# EAGLE design charliewatch (EAGLE 9.4.0)
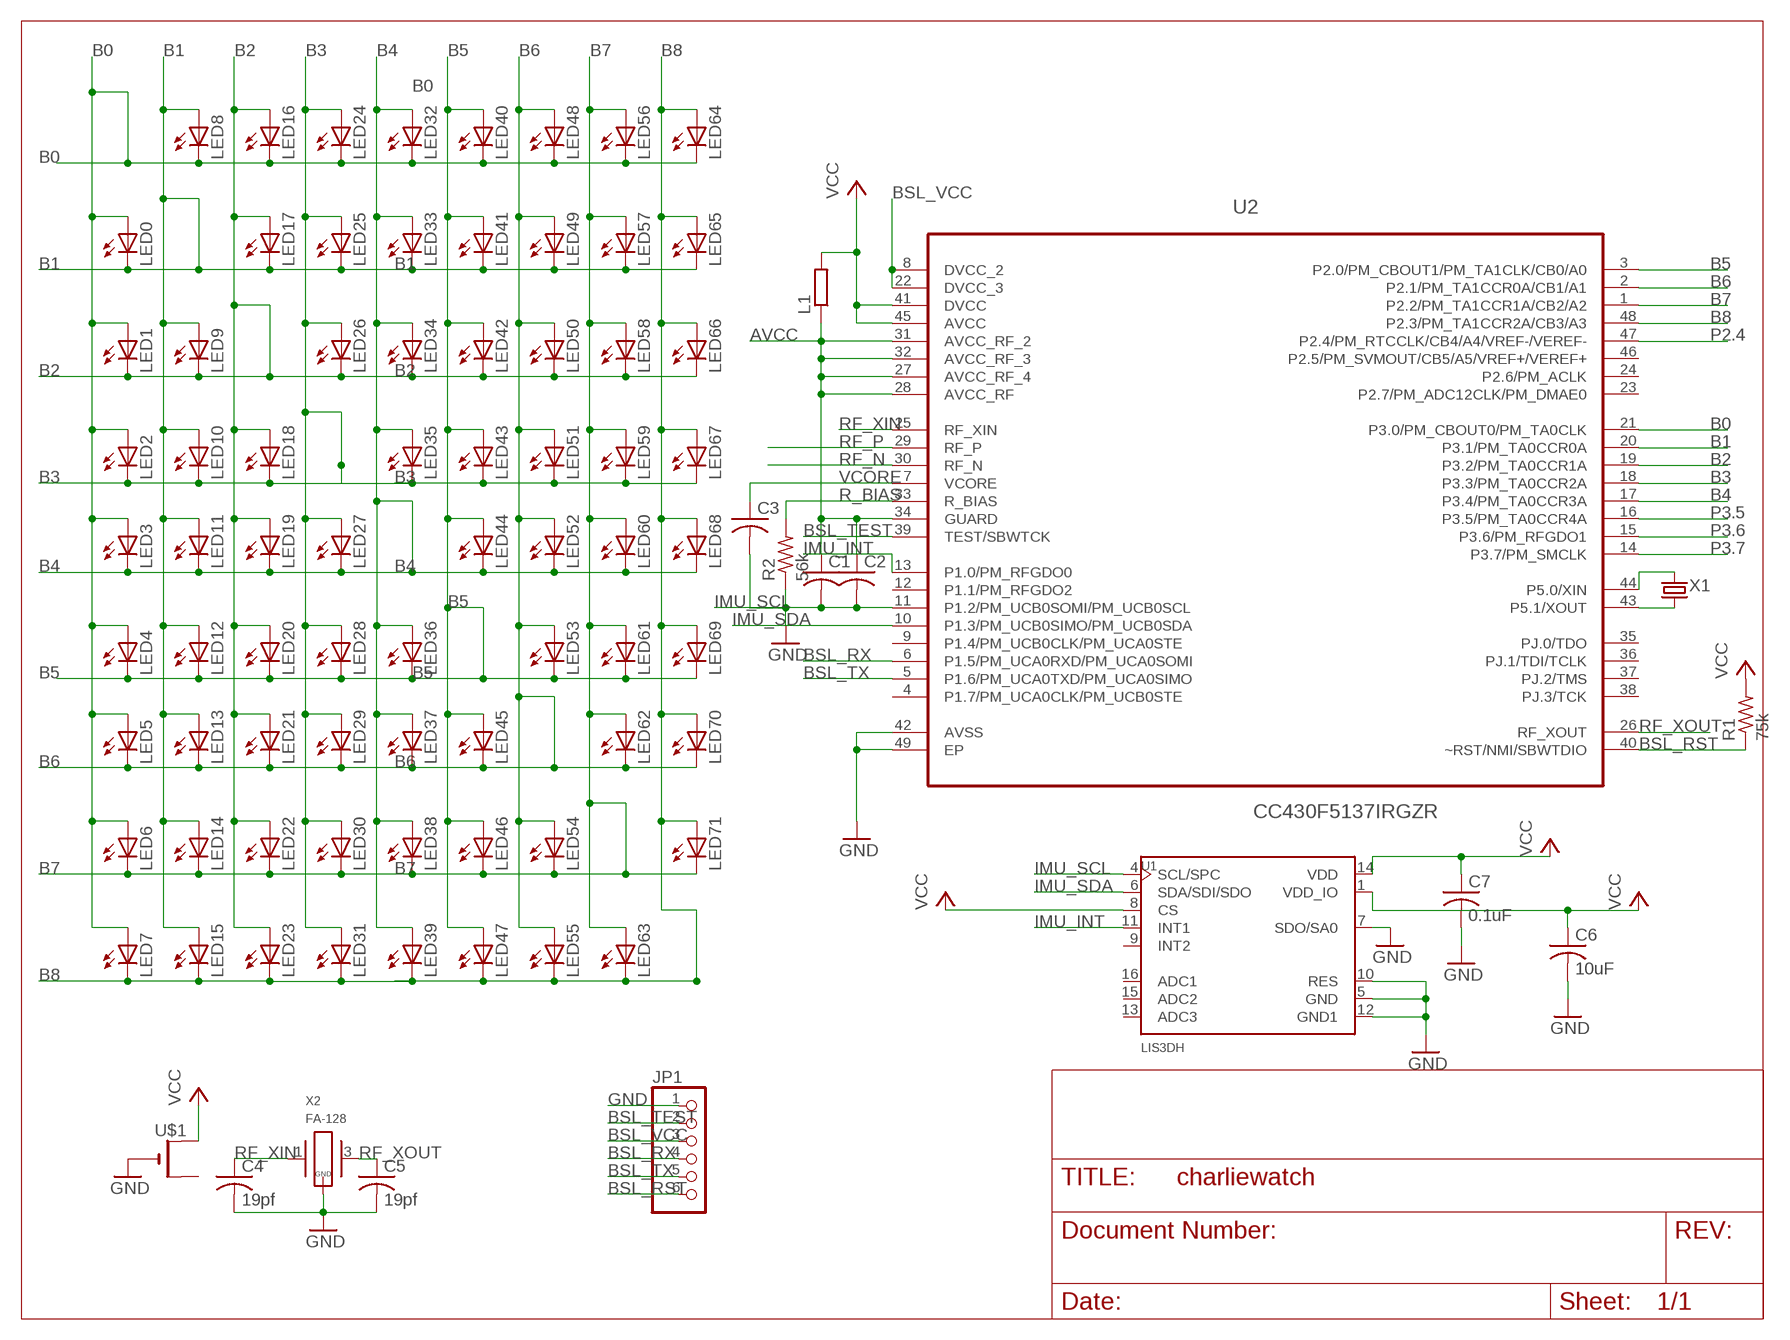
[diagram p0: schematic, sheet 1]

## Parts
C1  C-USC0603  [C0603]
C2  C-USC0603  [C0603]
C3  C-USC0603  [C0603]
C4  19pf  C-USC0603  [C0603]
C5  19pf  C-USC0603  [C0603]
C6  10uF  C-USC0603  [C0603]
C7  0.1uF  C-USC0603  [C0603]
JP1  PINHD-1X6LOCK  [1X06-BIGLOCK]
L1  R-EU_R0603  [R0603]
LED0  LEDCHIPLED_0603  [CHIPLED_0603]
LED1  LEDCHIPLED_0603  [CHIPLED_0603]
LED2  LEDCHIPLED_0603  [CHIPLED_0603]
LED3  LEDCHIPLED_0603  [CHIPLED_0603]
LED4  LEDCHIPLED_0603  [CHIPLED_0603]
LED5  LEDCHIPLED_0603  [CHIPLED_0603]
LED6  LEDCHIPLED_0603  [CHIPLED_0603]
LED7  LEDCHIPLED_0603  [CHIPLED_0603]
LED8  LEDCHIPLED_0603  [CHIPLED_0603]
LED9  LEDCHIPLED_0603  [CHIPLED_0603]
LED10  LEDCHIPLED_0603  [CHIPLED_0603]
LED11  LEDCHIPLED_0603  [CHIPLED_0603]
LED12  LEDCHIPLED_0603  [CHIPLED_0603]
LED13  LEDCHIPLED_0603  [CHIPLED_0603]
LED14  LEDCHIPLED_0603  [CHIPLED_0603]
LED15  LEDCHIPLED_0603  [CHIPLED_0603]
LED16  LEDCHIPLED_0603  [CHIPLED_0603]
LED17  LEDCHIPLED_0603  [CHIPLED_0603]
LED18  LEDCHIPLED_0603  [CHIPLED_0603]
LED19  LEDCHIPLED_0603  [CHIPLED_0603]
LED20  LEDCHIPLED_0603  [CHIPLED_0603]
LED21  LEDCHIPLED_0603  [CHIPLED_0603]
LED22  LEDCHIPLED_0603  [CHIPLED_0603]
LED23  LEDCHIPLED_0603  [CHIPLED_0603]
LED24  LEDCHIPLED_0603  [CHIPLED_0603]
LED25  LEDCHIPLED_0603  [CHIPLED_0603]
LED26  LEDCHIPLED_0603  [CHIPLED_0603]
LED27  LEDCHIPLED_0603  [CHIPLED_0603]
LED28  LEDCHIPLED_0603  [CHIPLED_0603]
LED29  LEDCHIPLED_0603  [CHIPLED_0603]
LED30  LEDCHIPLED_0603  [CHIPLED_0603]
LED31  LEDCHIPLED_0603  [CHIPLED_0603]
LED32  LEDCHIPLED_0603  [CHIPLED_0603]
LED33  LEDCHIPLED_0603  [CHIPLED_0603]
LED34  LEDCHIPLED_0603  [CHIPLED_0603]
LED35  LEDCHIPLED_0603  [CHIPLED_0603]
LED36  LEDCHIPLED_0603  [CHIPLED_0603]
LED37  LEDCHIPLED_0603  [CHIPLED_0603]
LED38  LEDCHIPLED_0603  [CHIPLED_0603]
LED39  LEDCHIPLED_0603  [CHIPLED_0603]
LED40  LEDCHIPLED_0603  [CHIPLED_0603]
LED41  LEDCHIPLED_0603  [CHIPLED_0603]
LED42  LEDCHIPLED_0603  [CHIPLED_0603]
LED43  LEDCHIPLED_0603  [CHIPLED_0603]
LED44  LEDCHIPLED_0603  [CHIPLED_0603]
LED45  LEDCHIPLED_0603  [CHIPLED_0603]
LED46  LEDCHIPLED_0603  [CHIPLED_0603]
LED47  LEDCHIPLED_0603  [CHIPLED_0603]
LED48  LEDCHIPLED_0603  [CHIPLED_0603]
LED49  LEDCHIPLED_0603  [CHIPLED_0603]
LED50  LEDCHIPLED_0603  [CHIPLED_0603]
LED51  LEDCHIPLED_0603  [CHIPLED_0603]
LED52  LEDCHIPLED_0603  [CHIPLED_0603]
LED53  LEDCHIPLED_0603  [CHIPLED_0603]
LED54  LEDCHIPLED_0603  [CHIPLED_0603]
LED55  LEDCHIPLED_0603  [CHIPLED_0603]
LED56  LEDCHIPLED_0603  [CHIPLED_0603]
LED57  LEDCHIPLED_0603  [CHIPLED_0603]
LED58  LEDCHIPLED_0603  [CHIPLED_0603]
LED59  LEDCHIPLED_0603  [CHIPLED_0603]
LED60  LEDCHIPLED_0603  [CHIPLED_0603]
LED61  LEDCHIPLED_0603  [CHIPLED_0603]
LED62  LEDCHIPLED_0603  [CHIPLED_0603]
LED63  LEDCHIPLED_0603  [CHIPLED_0603]
LED64  LEDCHIPLED_0603  [CHIPLED_0603]
LED65  LEDCHIPLED_0603  [CHIPLED_0603]
LED66  LEDCHIPLED_0603  [CHIPLED_0603]
LED67  LEDCHIPLED_0603  [CHIPLED_0603]
LED68  LEDCHIPLED_0603  [CHIPLED_0603]
LED69  LEDCHIPLED_0603  [CHIPLED_0603]
LED70  LEDCHIPLED_0603  [CHIPLED_0603]
LED71  LEDCHIPLED_0603  [CHIPLED_0603]
R1  75k  R-US_R0603  [R0603]
R2  56k  R-US_R0603  [R0603]
U1  LIS3DH  [PQFN50P300X300X100-16N]
U2  CC430F5137IRGZR  [QFN50P700X700X100-49N]
U$1  CR2032SMT  [CR2032-SMD]
X1  CRYSTALS-NOGND-IQXC-25  [2.0X1.2-2PAD]
X2  FA-128  [FA-128]

## Nets
AVCC: C1.1 C2.1 L1.1 U2.27(AVCC_RF_4) U2.28(AVCC_RF) U2.31(AVCC_RF_2) U2.32(AVCC_RF_3) U2.34(GUARD)
B0: LED0.A LED1.A LED2.A LED3.A LED4.A LED5.A LED6.A LED7.A LED8.C LED16.C LED24.C LED32.C LED40.C LED48.C LED56.C LED64.C U2.21(P3.0/PM_CBOUT0/PM_TA0CLK)
B1: LED0.C LED8.A LED9.A LED10.A LED11.A LED12.A LED13.A LED14.A LED15.A LED17.C LED25.C LED33.C LED41.C LED49.C LED57.C LED65.C U2.20(P3.1/PM_TA0CCR0A)
B2: LED1.C LED9.C LED16.A LED17.A LED18.A LED19.A LED20.A LED21.A LED22.A LED23.A LED26.C LED34.C LED42.C LED50.C LED58.C LED66.C U2.19(P3.2/PM_TA0CCR1A)
B3: LED2.C LED10.C LED18.C LED24.A LED25.A LED26.A LED27.A LED28.A LED29.A LED30.A LED31.A LED35.C LED43.C LED51.C LED59.C LED67.C U2.18(P3.3/PM_TA0CCR2A)
B4: LED3.C LED11.C LED19.C LED27.C LED32.A LED33.A LED34.A LED35.A LED36.A LED37.A LED38.A LED39.A LED44.C LED52.C LED60.C LED68.C U2.17(P3.4/PM_TA0CCR3A)
B5: LED4.C LED12.C LED20.C LED28.C LED36.C LED40.A LED41.A LED42.A LED43.A LED44.A LED45.A LED46.A LED47.A LED53.C LED61.C LED69.C U2.3(P2.0/PM_CBOUT1/PM_TA1CLK/CB0/A0)
B6: LED5.C LED13.C LED21.C LED29.C LED37.C LED45.C LED48.A LED49.A LED50.A LED51.A LED52.A LED53.A LED54.A LED55.A LED62.C LED70.C U2.2(P2.1/PM_TA1CCR0A/CB1/A1)
B7: LED6.C LED14.C LED22.C LED30.C LED38.C LED46.C LED54.C LED56.A LED57.A LED58.A LED59.A LED60.A LED61.A LED62.A LED63.A LED71.C U2.1(P2.2/PM_TA1CCR1A/CB2/A2)
B8: LED7.C LED15.C LED23.C LED31.C LED39.C LED47.C LED55.C LED63.C LED64.A LED65.A LED66.A LED67.A LED68.A LED69.A LED70.A LED71.A U2.48(P2.3/PM_TA1CCR2A/CB3/A3)
BSL_RST: JP1.6 R1.1 U2.40(~RST/NMI/SBWTDIO)
BSL_RX: JP1.4 U2.6(P1.5/PM_UCA0RXD/PM_UCA0SOMI)
BSL_TEST: JP1.2 U2.39(TEST/SBWTCK)
BSL_TX: JP1.5 U2.5(P1.6/PM_UCA0TXD/PM_UCA0SIMO)
BSL_VCC: JP1.3 U2.8(DVCC_2) U2.22(DVCC_3)
GND: C1.2 C2.2 C3.2 C4.2 C5.2 C6.2 C7.2 JP1.1 R2.1 U1.5(GND) U1.7(SDO/SA0) U1.10(RES) U1.12(GND1) U2.42(AVSS) U2.49(EP) U$1.- X2.2(GND) X2.4(GND)
IMU_INT: U1.11(INT1) U2.13(P1.0/PM_RFGDO0)
IMU_SCL: U1.4(SCL/SPC) U2.11(P1.2/PM_UCB0SOMI/PM_UCB0SCL)
IMU_SDA: U1.6(SDA/SDI/SDO) U2.10(P1.3/PM_UCB0SIMO/PM_UCB0SDA)
P2.4: U2.47(P2.4/PM_RTCCLK/CB4/A4/VREF-/VEREF-)
P3.5: U2.16(P3.5/PM_TA0CCR4A)
P3.6: U2.15(P3.6/PM_RFGDO1)
P3.7: U2.14(P3.7/PM_SMCLK)
R_BIAS: R2.2 U2.33(R_BIAS)
RF_N: U2.30(RF_N)
RF_P: U2.29(RF_P)
RF_XIN: C4.1 U2.25(RF_XIN) X2.1
RF_XOUT: C5.1 U2.26(RF_XOUT) X2.3
VCC: C6.1 C7.1 L1.2 R1.2 U1.1(VDD_IO) U1.8(CS) U1.14(VDD) U2.41(DVCC) U2.45(AVCC) U$1.+$1(+)
VCORE: C3.1 U2.7(VCORE)
XIN: U2.44(P5.0/XIN) X1.2
XOUT: U2.43(P5.1/XOUT) X1.1
Unconnected: U1.9(INT2) U1.13(ADC3) U1.15(ADC2) U1.16(ADC1) U2.4(P1.7/PM_UCA0CLK/PM_UCB0STE) U2.9(P1.4/PM_UCB0CLK/PM_UCA0STE) U2.12(P1.1/PM_RFGDO2) U2.23(P2.7/PM_ADC12CLK/PM_DMAE0) U2.24(P2.6/PM_ACLK) U2.35(PJ.0/TDO) U2.36(PJ.1/TDI/TCLK) U2.37(PJ.2/TMS) U2.38(PJ.3/TCK) U2.46(P2.5/PM_SVMOUT/CB5/A5/VREF+/VEREF+) U$1.+$2(+1)

## Library data of the parts
C1-C7 = resistor:C-US: CAPACITOR, American symbol
JP1 = adafruit:PINHD-1X6: PIN HEADER
L1 = rcl:R-EU_: RESISTOR, European symbol
LED0 LED1-LED71 = led:LED: LED OSRAM: - CHIPLED LG R971, LG N971, LY N971, LG Q971, LY Q971, LO R971, LY R971 LH N974, LH R974 LS Q976, LO Q976, LY Q976 LO Q996 - Hyper CHIPLED LW Q18S LB Q993, LB Q99A, LB R99A - SideLED LS A670, LO A670, LY A670, LG A670, LP A670 LB A673, LV A673, LT A673, LW A673 LH A674 LY A675 LS A676, LA A676, LO A676, LY A676, LW A676 LS A679, LY A679, LG A679 - Hyper Micro SIDELED® LS Y876, LA Y876, LO Y876, LY Y876 LT Y87S - SmartLED LW L88C, LW L88S LB L89C, LB L89S, LG L890 LS L89K, LO L89K, LY L89K LS L896, LA L896, LO L896, LY L896 - TOPLED LS T670, LO T670, LY T670, LG T670, LP T670 LSG T670, LSP T670, LSY T670, LOP T670, LYG T670 LG T671, LOG T671, LSG T671 LB T673, LV T673, LT T673, LW T673 LH T674 LS T676, LA T676, LO T676, LY T676, LB T676, LH T676, LSB T676, LW T676 LB T67C, LV T67C, LT T67C, LS T67K, LO T67K, LY T67K, LW E67C LS E67B, LA E67B, LO E67B, LY E67B, LB E67C, LV E67C, LT E67C LW T67C LS T679, LY T679, LG T679 LS T770, LO T770, LY T770, LG T770, LP T770 LB T773, LV T773, LT T773, LW T773 LH T774 LS E675, LA E675, LY E675, LS T675 LS T776, LA T776, LO T776, LY T776, LB T776 LHGB T686 LT T68C, LB T68C - Hyper Mini TOPLED® LB M676 - Mini TOPLED Santana® LG M470 LS M47K, LO M47K, LY M47K Source: http://www.osram.convergy.de LUXEON: - LUMILED® LXK2-PW12-R00, LXK2-PW12-S00, LXK2-PW14-U00, LXK2-PW14-V00 LXK2-PM12-R00, LXK2-PM12-S00, LXK2-PM14-U00 LXK2-PE12-Q00, LXK2-PE12-R00, LXK2-PE12-S00, LXK2-PE14-T00, LXK2-PE14-U00 LXK2-PB12-K00, LXK2-PB12-L00, LXK2-PB12-M00, LXK2-PB14-N00, LXK2-PB14-P00, LXK2-PB14-Q00 LXK2-PR12-L00, LXK2-PR12-M00, LXK2-PR14-Q00, LXK2-PR14-R00 LXK2-PD12-Q00, LXK2-PD12-R00, LXK2-PD12-S00 LXK2-PH12-R00, LXK2-PH12-S00 LXK2-PL12-P00, LXK2-PL12-Q00, LXK2-PL12-R00 Source: www.luxeon.com KINGBRIGHT: KA-3528ASYC Source: www.kingbright.com
R1 R2 = rcl:R-US_: RESISTOR, American symbol
U1 = LIS3DH:LIS3DH: MEMS digital output motion sensor ultra low-power high performance 3-axes "nano" accelerometer; AVAILABILITY: Unavailable; DESCRIPTION: MEMS digital output motion sensor ultra low-power high performance 3-axes nano accelerometer; MF: STMicroelectronics; MP: LIS3DH; PACKAGE: LGA-16 STMicroelectronics; PRICE: None
U2 = Texas Instruments_By_element14_Batch_1:CC430F5137IRGZR: MSP430 SoC with RF Core; MPN: CC430F5137IRGZR; OC_FARNELL: -; OC_NEWARK: 68R5912; PACKAGE: QFN-48; SUPPLIER: TEXAS INSTRUMENTS
U$1 = adafruit:CR2032
X1 = IQD-Frequency-Products:CRYSTALS-NOGND: CRYSTALS CAN NOT GROUNDED
X2 = crystals:FA-128: Epson MHz RANGE CRYSTAL UNIT ULTRA MINIATURE SIZE LOW PROFILE SMD http://www.digikey.com/product-search/en?FV=ffec63d1

## Net classes
0 default: width 0.102 mm, drill 0.025 mm, clearance 0.025 mm

## Board
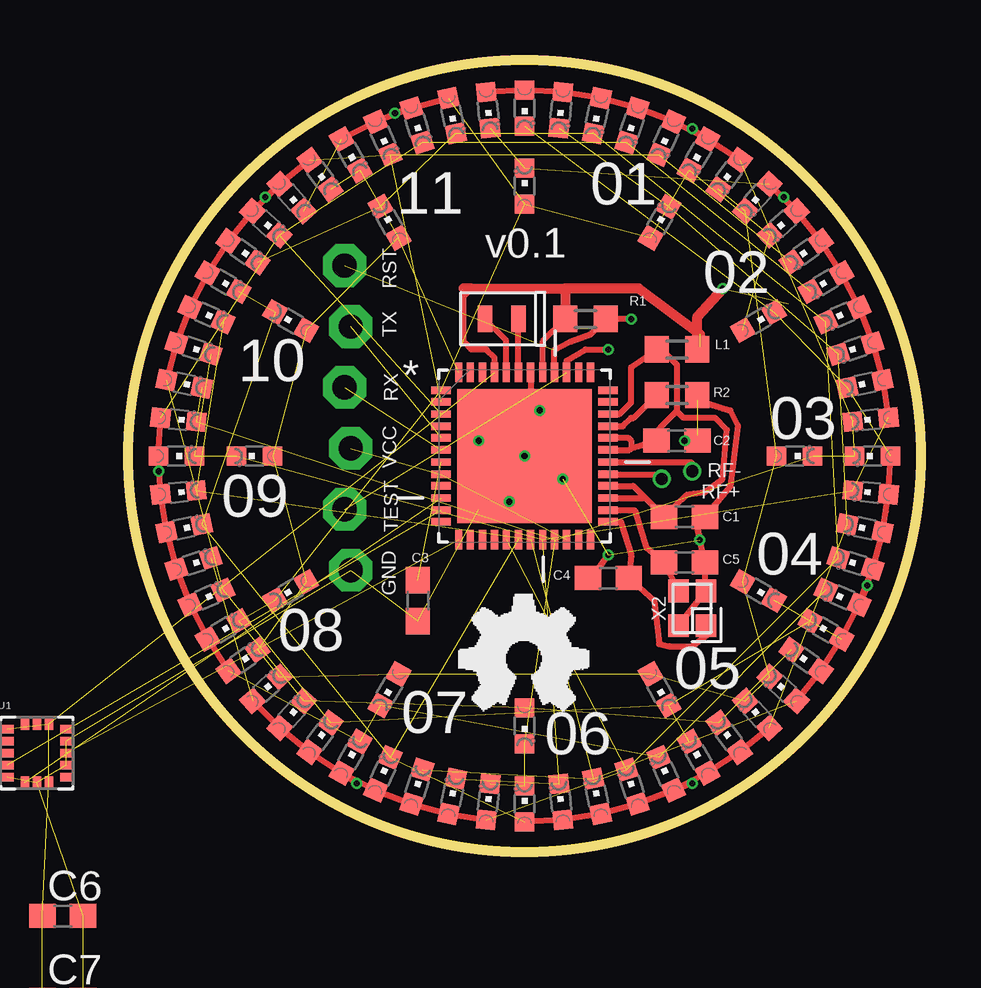
[diagram p1: board, top side]
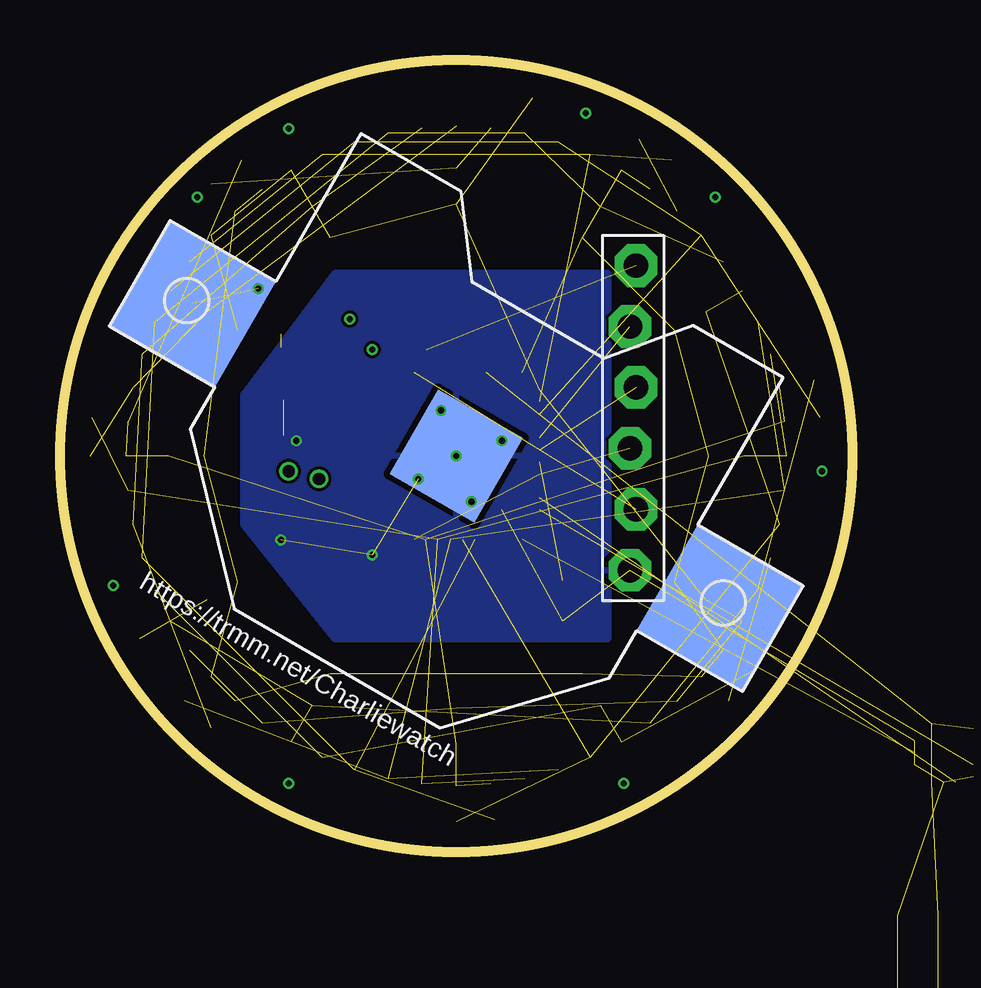
[diagram p2: board, bottom side, seen from below]

Size 33.02 x 33.02 mm. Coordinates in mm from the lower left corner, seen from the top.
Outline: circle at 16.51,16.51 radius 16.51
Copper layers (1*16): Top 0.035mm / dielectric 1.5mm / Bottom 0.035mm
Design rules "default *": minimum track width 10mil, minimum drill 10mil, track to track 5mil, track to pad 5mil, pad to pad 5mil, via to via 5mil, smd to smd 5mil, copper to edge 40mil, drill to drill 8mil, minimum pad ring 10mil, minimum via ring 4mil, stop-mask expansion 4mil, vias tented up to drill 15mil, thermal gap 10mil

### Footprints (pad centres in the part's own frame; a part is rotated, then mirrored left to right if it is on the bottom)
C0603 = smd 1.1 x 1: 1 -0.85,0; 2 0.85,0
1X06-BIGLOCK = drill 1.016 pad 1.778 octagon: 1 -6.35,0.127; 2 -3.81,-0.127; 3 -1.27,0.127; 4 1.27,-0.127; 5 3.81,0.127; 6 6.35,-0.127
R0603 = smd 1 x 1.1: 1 -0.85,0; 2 0.85,0
CHIPLED_0603 = smd 0.8 x 0.8: A 0,-0.75; C 0,0.75
PQFN50P300X300X100-16N = smd 0.52 x 0.35: 1 -1.225,1; 2 -1.225,0.5; 3 -1.225,0; 4 -1.225,-0.5; 5 -1.225,-1; 9 1.225,-1; 10 1.225,-0.5; 11 1.225,0; 12 1.225,0.5; 13 1.225,1 | smd 0.35 x 0.52: 6 -0.5,-1.225; 7 0,-1.225; 8 0.5,-1.225; 14 0.5,1.225; 15 0,1.225; 16 -0.5,1.225
QFN50P700X700X100-49N = smd 0.813 x 0.305: 1 -3.48,2.743; 2 -3.48,2.261; 3 -3.48,1.753; 4 -3.48,1.245; 5 -3.48,0.762; 6 -3.48,0.254; 7 -3.48,-0.254; 8 -3.48,-0.762; 9 -3.48,-1.245; 10 -3.48,-1.753; 11 -3.48,-2.261; 12 -3.48,-2.743; 25 3.48,-2.743; 26 3.48,-2.261; 27 3.48,-1.753; 28 3.48,-1.245; 29 3.48,-0.762; 30 3.48,-0.254; 31 3.48,0.254; 32 3.48,0.762; 33 3.48,1.245; 34 3.48,1.753; 35 3.48,2.261; 36 3.48,2.743 | smd 0.305 x 0.813: 13 -2.743,-3.48; 14 -2.261,-3.48; 15 -1.753,-3.48; 16 -1.245,-3.48; 17 -0.762,-3.48; 18 -0.254,-3.48; 19 0.254,-3.48; 20 0.762,-3.48; 21 1.245,-3.48; 22 1.753,-3.48; 23 2.261,-3.48; 24 2.743,-3.48; 37 2.743,3.48; 38 2.261,3.48; 39 1.753,3.48; 40 1.245,3.48; 41 0.762,3.48; 42 0.254,3.48; 43 -0.254,3.48; 44 -0.762,3.48; 45 -1.245,3.48; 46 -1.753,3.48; 47 -2.261,3.48; 48 -2.743,3.48 | smd 5.588 x 5.588: 49 0,0
CR2032-SMD = smd 5.08 x 5.08: +$1 -12.7,0; +$2 12.7,0 | smd 4.064 x 4.064: - 0,0
2.0X1.2-2PAD = smd 0.6 x 1.1: 1 -0.7,0; 2 0.7,0
FA-128 = smd 0.95 x 0.85: 1 -0.725,-0.575; 2 0.725,-0.575; 3 0.725,0.575; 4 -0.725,0.575

### Placement (x,y rotation side)
C1  23.18,13.97 0 top
C2  22.86,17.15 0 top
C3  12.07,10.48 270 top
C4  20,11.43 180 top
C5  23.18,12.07 0 top
C6  -2.73,-2.67 0 top
C7  -2.73,-6.16 0 top  (outside the outline)
JP1  9.14,18.1 90 bottom
L1  22.86,20.96 0 top
LED0  14.99,30.93 186 top
LED1  16.51,31.01 180 top
LED2  18.03,30.93 174 top
LED3  19.52,30.69 168 top
LED4  20.99,30.3 162 top
LED5  22.41,29.76 156 top
LED6  23.76,29.07 150 top
LED7  25.03,28.24 144 top
LED8  30.93,18.03 96 top
LED9  30.69,19.52 102 top
LED10  30.3,20.99 108 top
LED11  29.76,22.41 114 top
LED12  29.07,23.76 120 top
LED13  28.24,25.03 126 top
LED14  27.28,26.21 132 top
LED15  26.21,27.28 138 top
LED16  31.01,16.51 90 top
LED17  30.93,14.99 84 top
LED18  30.69,13.5 78 top
LED19  30.3,12.03 72 top
LED20  29.76,10.61 66 top
LED21  29.07,9.26 60 top
LED22  28.24,7.99 54 top
LED23  27.28,6.81 48 top
LED24  16.51,2.01 0 top
LED25  18.03,2.09 6 top
LED26  19.52,2.33 12 top
LED27  20.99,2.72 18 top
LED28  22.41,3.26 24 top
LED29  23.76,3.95 30 top
LED30  25.03,4.78 36 top
LED31  26.21,5.74 42 top
LED32  14.99,2.09 354 top
LED33  13.5,2.33 348 top
LED34  12.03,2.72 342 top
LED35  10.61,3.26 336 top
LED36  9.26,3.95 330 top
LED37  7.99,4.78 324 top
LED38  6.81,5.74 318 top
LED39  5.74,6.81 312 top
LED40  2.09,18.03 264 top
LED41  2.01,16.51 270 top
LED42  2.09,14.99 276 top
LED43  2.33,13.5 282 top
LED44  2.72,12.03 288 top
LED45  3.26,10.61 294 top
LED46  3.95,9.26 300 top
LED47  4.78,7.99 306 top
LED48  2.33,19.52 258 top
LED49  2.72,20.99 252 top
LED50  3.26,22.41 246 top
LED51  3.95,23.76 240 top
LED52  4.78,25.03 234 top
LED53  5.74,26.21 228 top
LED54  6.81,27.28 222 top
LED55  7.99,28.24 216 top
LED56  16.51,5.26 180 top
LED57  16.51,27.76 0 top
LED58  26.25,22.14 300 top
LED59  22.14,26.25 330 top
LED60  13.5,30.69 192 top
LED61  12.03,30.3 198 top
LED62  10.61,29.76 204 top
LED63  9.26,29.07 210 top
LED64  27.76,16.51 270 top
LED65  5.26,16.51 90 top
LED66  26.25,10.88 240 top
LED67  6.77,22.14 60 top
LED68  10.88,26.25 30 top
LED69  10.88,6.77 150 top
LED70  22.14,6.77 210 top
LED71  6.77,10.88 120 top
R1  19.05,22.23 180 top
R2  22.86,19.05 180 top
U1  -3.81,4.13 0 top
U2  16.51,16.51 0 top
U$1  16.51,16.51 330 bottom
X1  15.56,22.23 180 top
X2  23.5,10.16 90 top

### Tracks (layer width: path | path; a pad name or v marks a point on that pad's centre or on a via)
AVCC
  Top 0.254: U2.32 20.83,17.27 20.96,17.15 20.96,16.83 | U2.31 20.89,16.76 20.96,16.83 | U2.34 20.49,18.26 20.96,18.73 20.96,20.22 L1.1 22.23,20.96 22.86,20.32 22.86,18.39 | C2.1 21.45,16.98 | 21.45,16.98 20.96,16.83 | 22.86,18.39 21.45,16.98 | 22.86,18.39 23.15,18.1 24.45,18.1 24.94,17.6 24.77,15.56 23.99,14.99 23.25,14.88 22.3,14 C1.1 21.54,14.76 | U2.27 21.54,14.76 | U2.28 21.03,15.27 21.54,14.76
B0  (via drill 0.25)  (9 unrouted)
  Top 0.254: LED7.A LED6.A | LED6.A LED5.A LED4.A LED3.A LED2.A LED1.A LED0.A | U2.21 17.78,13.01 | v23.5,30.16 LED6.A
B1  (via drill 0.25)  (9 unrouted)
  Top 0.254: LED8.A LED9.A LED10.A LED11.A LED12.A LED13.A LED14.A | LED14.A LED15.A | v27.31,27.31 LED14.A
B2  (via drill 0.25)  (9 unrouted)
  Top 0.254: LED23.A LED22.A LED21.A LED20.A | LED20.A LED19.A LED18.A 31.57,14.22 LED17.A LED16.A | v30.8,11.11 LED20.A
B3  (via drill 0.25)  (9 unrouted)
  Top 0.254: LED24.A LED25.A LED26.A LED27.A LED28.A | LED31.A LED30.A LED29.A LED28.A | v23.5,2.86 LED28.A
B4  (via drill 0.25)  (9 unrouted)
  Top 0.254: LED36.A LED37.A LED38.A LED39.A | LED36.A LED35.A LED34.A LED33.A LED32.A | LED36.A v9.53,2.86
B5  (via drill 0.25)  (9 unrouted)
  Top 0.254: LED41.A LED42.A LED43.A LED44.A LED45.A LED46.A LED47.A | LED41.A LED40.A | LED41.A v1.27,15.88
B6  (via drill 0.25)  (9 unrouted)
  Top 0.254: LED55.A LED54.A | LED54.A LED53.A LED52.A LED51.A LED50.A LED49.A LED48.A | LED54.A v5.72,27.31
B7  (via drill 0.25)  (13 unrouted)
  Top 0.254: LED61.A LED60.A | LED61.A LED62.A LED63.A | LED61.A v11.11,30.8
B8  (16 unrouted)
BSL_RST  (via drill 0.25)  (1 unrouted)
  Top 0.254: U2.40 17.76,20.93 18.42,21.27 19.27,21.59 R1.1 v20.96,22.23
BSL_RX  (1 unrouted)
BSL_TEST  (via drill 0.25)  (1 unrouted)
  Top 0.254: U2.39 18.26,20.49 19.05,20.96 v20,20.96
BSL_TX  (1 unrouted)
BSL_VCC  (2 unrouted)
GND  (via drill 0.25)  (11 unrouted)
  Top 0.254: U2.42 16.76,18.48 U$1.- | R2.1 23.71,18.84 | C2.2 23.71,17.25 | 23.71,13.55 C5.2 X2.2 X2.4 | 23.71,13.55 v23.81,13.02 | 23.71,13.55 C1.2 25.08,15.24 25.4,17.78 25.08,18.42 23.71,18.84 | C4.2 19.15,11.22 v20,12.38 | 23.71,18.84 23.92,18.84 | 23.71,17.36 23.71,17.25 | 23.71,17.25 v23.18,17.15 | v14.61,17.15 U$1.- | v15.88,14.61 U$1.- | v17.15,18.42 U$1.- | v18.1,15.56 U$1.-
  Top 0.61: U$1.- 14.61,14.61 14.61,14.29
  other vias: 16.51,16.51
  pour Bottom: 10.16,24.13 21.59,24.13 25.4,19.05 25.4,13.65 21.59,8.89 10.16,8.89
IMU_INT  (1 unrouted)
IMU_SCL  (1 unrouted)
IMU_SDA  (1 unrouted)
R_BIAS
  Top 0.254: U2.33 20.61,17.76 20.96,18.1 21.06,18.1 R2.2
RF_N  (via drill 0.51)
  Top 0.254: U2.30 23.43,16.26 arc-90 v23.5,15.88
RF_P  (via drill 0.51)
  Top 0.254: U2.29 22.03,15.75 arc-90 v22.23,15.56
RF_XIN
  Top 0.254: U2.25 20.52,13.77 20.96,12.38 C4.1 21.91,10.48 22.12,8.68 22.54,8.57 23.5,8.57 24.13,9.06 X2.1
RF_XOUT
  Top 0.254: U2.26 21.1,14.25 21.59,12.7 C5.1 X2.3
VCC  (via drill 0.25)  (7 unrouted)
  Top 0.254: U2.41 17.27,21.3 R1.2 | U2.45 15.27,20.61 14.92,20.96 14.29,20.96 13.97,21.27 13.97,23.18 14.29,23.5 | 23.81,21.06 L1.2
  Top 0.406: 18.2,23.5 14.29,23.5 13.97,23.5 | 18.2,23.5 R1.2 | L1.2 23.71,22.33 v24.77,23.5 | 23.81,21.59 21.27,23.5 18.2,23.5
VCORE  (1 unrouted)
XIN
  Top 0.254: U2.44 15.75,21.33 X1.2
XOUT
  Top 0.254: U2.43 X1.1

### Text on the board
tNames: 01 | 11 | v0.1 | RST | 02 | TX | 10 | RX | 03 | VCC | RF- | RF+ | 09 | TEST | GND | 04 | 08 | 05 | 07 | 06
bNames: https://trmm.net/Charliewatch